# EAGLE schematic Instrument (EAGLE 6.5.0)
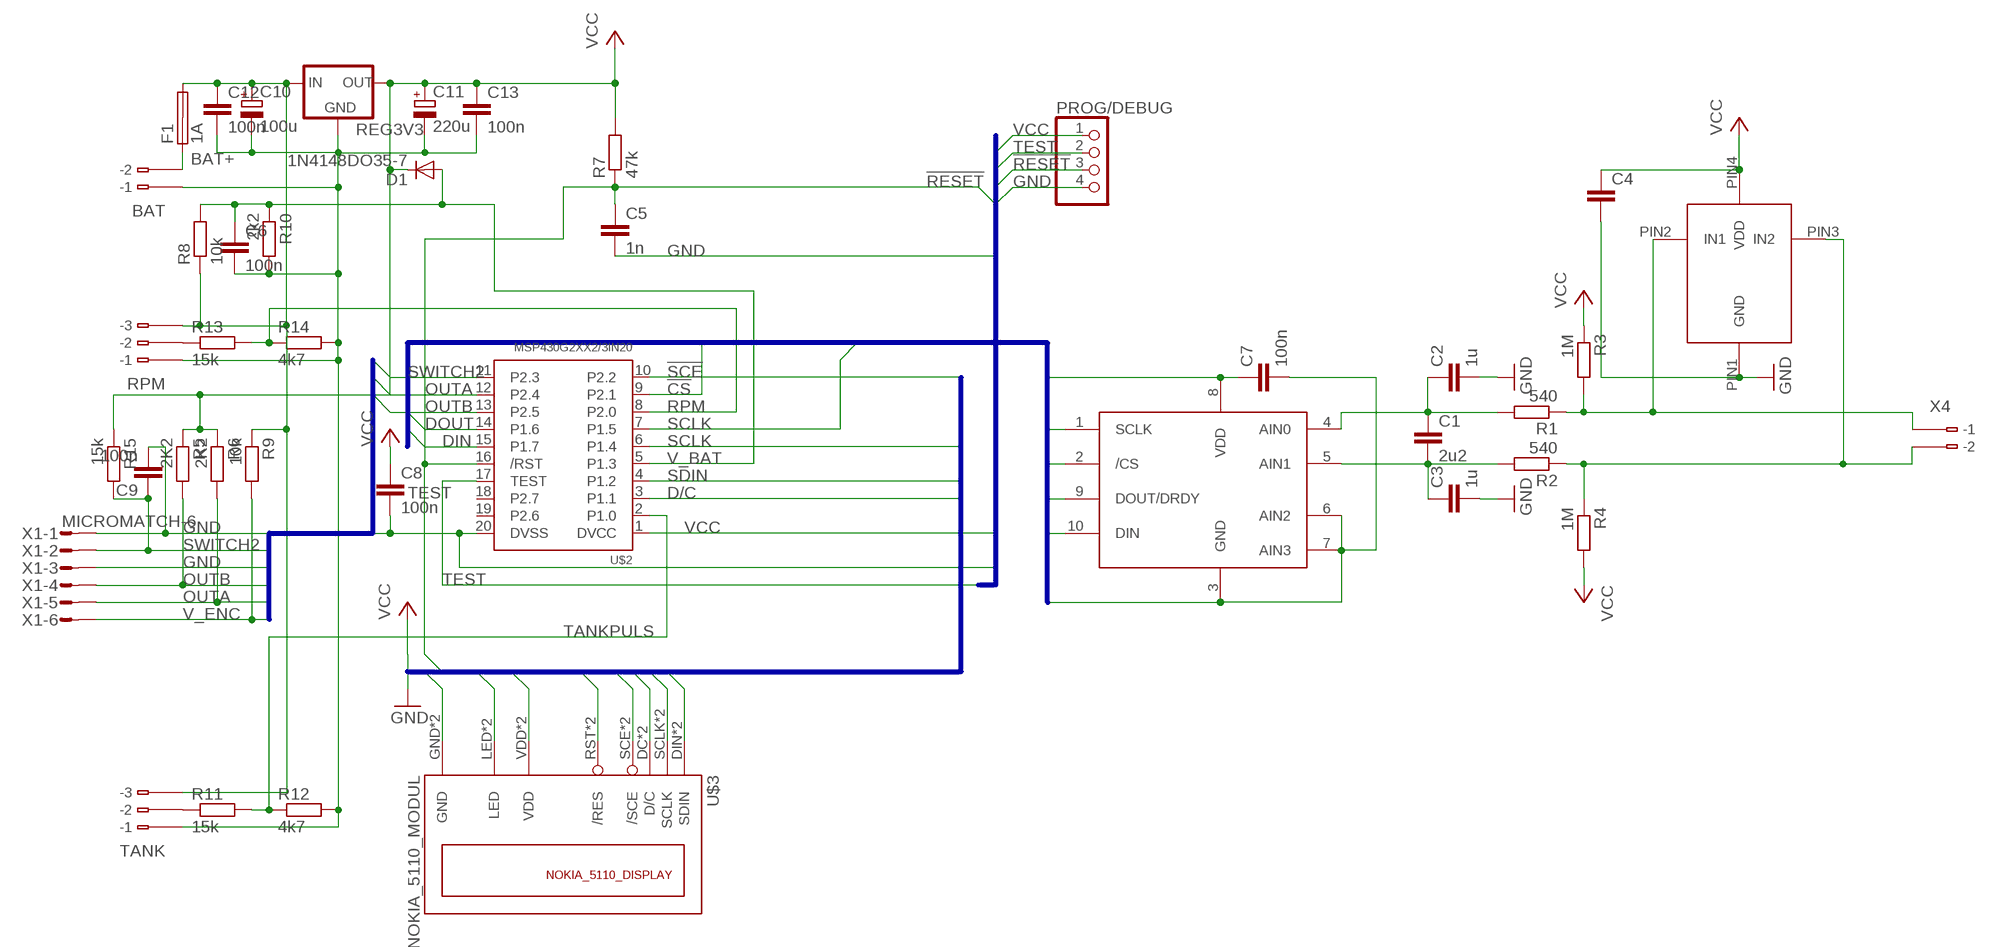
[diagram p0: schematic, sheet 1]

## Parts
BAT  233-102  [233-102]
C1  2u2  C-EU025-050X050  [C025-050X050]
C2  1u  C-EU025-050X050  [C025-050X050]
C3  1u  C-EU025-050X050  [C025-050X050]
C4  C-EU025-050X050  [C025-050X050]
C5  1n  C-EU025-024X044  [C025-024X044]
C6  100n  C-EU025-050X050  [C025-050X050]
C7  100n  C-EU025-050X050  [C025-050X050]
C8  100n  C-EU025-050X050  [C025-050X050]
C9  100n  C-EU025-050X050  [C025-050X050]
C10  100u  CPOL-EUE5-8.5  [E5-8,5]
C11  220u  CPOL-EUE5-8.5  [E5-8,5]
C12  100n  C-EU025-050X050  [C025-050X050]
C13  100n  C-EU025-050X050  [C025-050X050]
D1  1N4148DO35-7  [DO35-7]
F1  1A  SHK20Q  [SHK20Q]
PROG/DEBUG  PINHD-1X4  [1X04]
R1  540  R-EU_0207/2V  [0207/2V]
R2  540  R-EU_0207/2V  [0207/2V]
R3  1M  R-EU_0207/2V  [0207/2V]
R4  1M  R-EU_0207/2V  [0207/2V]
R5  2K2  R-EU_0207/2V  [0207/2V]
R6  2K2  R-EU_0207/2V  [0207/2V]
R7  47k  R-EU_0204/2V  [0204V]
R8  10k  R-EU_0204/5  [0204/5]
R9  10k  R-EU_0207/2V  [0207/2V]
R10  2k2  R-EU_0204/5  [0204/5]
R11  15k  R-EU_0207/2V  [0207/2V]
R12  4k7  R-EU_0207/2V  [0207/2V]
R13  15k  R-EU_0207/2V  [0207/2V]
R14  4k7  R-EU_0207/2V  [0207/2V]
R15  15k  R-EU_0207/2V  [0207/2V]
REG3V3  78MXXL  [78MXXL]
RPM  233-103  [233-103]
TANK  233-103  [233-103]
THERMO_ADC  ADS1118IDGST  [MSOP10]
U$1  TPD2E001DZDR  [PDSO-G4]
U$2  MSP430G2XX2/3IN20  [DIL20]
U$3  NOKIA_5110_MODUL  [CHINA_N5110]
X1  MICROMATCH-6  [MICROMATCH-6]
X4  233-102  [233-102]

## Nets
!CS: THERMO_ADC.2(/CS) U$2.9(P2.1)
!RESET: C5.1 PROG/DEBUG.3 R7.1 U$2.16(/RST) U$3.RST2(/RES) U$3.RST(/RES)
!SCE: U$2.10(P2.2) U$3.SCE2(/SCE) U$3.SCE(/SCE)
BAT+: C10.+ C12.1 F1.2A R8.1 R9.1 REG3V3.IN RPM.B3(B-3) TANK.B3(B-3)
D/C: U$2.3(P1.1) U$3.DC2(D/C) U$3.DC(D/C)
DIN: THERMO_ADC.10(DIN) U$2.15(P1.7)
DOUT: THERMO_ADC.9(DOUT/DRDY) U$2.14(P1.6)
GND: BAT.B1(B-1) C2.2 C3.2 C4.2 C5.2 C6.2 C7.2 C8.2 C9.2 C10.- C11.- C12.2 C13.2 PROG/DEBUG.4 R10.2 R12.2 R14.2 REG3V3.GND RPM.B1(B-1) TANK.B1(B-1) THERMO_ADC.3(GND) THERMO_ADC.6(AIN2) THERMO_ADC.7(AIN3) U$1.PIN1(GND) U$2.20(DVSS) U$3.GND U$3.GND2(GND) X1.1 X1.3
N$1: C1.1 C2.1 R1.2 THERMO_ADC.4(AIN0)
N$2: C1.2 C3.1 R2.2 THERMO_ADC.5(AIN1)
N$3: R1.1 R3.2 U$1.PIN2(IN1) X4.B1(B-1)
N$4: R2.1 R4.1 U$1.PIN3(IN2) X4.B2(B-2)
N$5: BAT.B2(B-2) F1.1A
N$6: R13.1 RPM.B2(B-2)
N$7: R11.1 TANK.B2(B-2)
OUTA: R6.2 U$2.12(P2.4) X1.5
OUTB: R5.2 U$2.13(P2.5) X1.4
RPM: R13.2 R14.1 U$2.8(P2.0)
SCLK: THERMO_ADC.1(SCLK) U$2.6(P1.4) U$2.7(P1.5) U$3.SCLK U$3.SCLK2(SCLK)
SDIN: U$2.4(P1.2) U$3.DIN2(SDIN) U$3.DIN(SDIN)
SWITCH2: C9.1 R15.2 U$2.11(P2.3) X1.2
TANKPULS: R11.2 R12.1 U$2.2(P1.0)
TEST: PROG/DEBUG.2 U$2.17(TEST)
V_BAT: C6.1 D1.A R8.2 R10.1 U$2.5(P1.3)
V_ENC: R9.2 X1.6
VCC: C4.1 C7.1 C8.1 C11.+ C13.1 D1.C PROG/DEBUG.1 R3.1 R4.2 R5.1 R6.1 R7.2 R15.1 REG3V3.OUT THERMO_ADC.8(VDD) U$1.PIN4(VDD) U$2.1(DVCC) U$3.LED U$3.LED2(LED) U$3.VDD U$3.VDD2(VDD)
Unconnected: BAT.A1(-1) BAT.A2(-2) F1.1B F1.2B RPM.A1(-1) RPM.A2(-2) RPM.A3(-3) TANK.A1(-1) TANK.A2(-2) TANK.A3(-3) U$2.18(P2.7) U$2.19(P2.6) X4.A1(-1) X4.A2(-2)

## Buses
GND,SWITCH1,SWITCH2,OUTA,OUTB,V_ENC
DISPLAY:GND,LED,VCC,!RESET,!SCE,SCLK,SDIN,D/C
VCC,GND,TEST,!RESET
VCC,GND,!CS,SCLK,DOUT,DIN

## Library data of the parts
BAT X4 = con-wago:233-102: WAGO Cage Clamp; MPN: 233-102; OC_FARNELL: unknown; OC_NEWARK: 28K9044
C1-C9 C12 C13 = rcl:C-EU: CAPACITOR, European symbol
C10 C11 = rcl:CPOL-EU: POLARIZED CAPACITOR, European symbol
D1 = diode:1N4148: DIODE high speed (Philips)
F1 = fuse:SHK20Q: FUSE HOLDER 5 x 20 mm, SH contact, E1207 Buerklin 64G6061; OC_FARNELL: unknown; OC_NEWARK: unknown
PROG/DEBUG = pinhead:PINHD-1X4: PIN HEADER
R1-R15 = rcl:R-EU_: RESISTOR, European symbol
REG3V3 = v-reg:78MXXL: VOLTAGE REGULATOR
RPM TANK = con-wago:233-103: WAGO Cage Clamp; MPN: 233-103; OC_FARNELL: unknown; OC_NEWARK: 28K9045
THERMO_ADC = instrument:ADS1118IDGST: The ADS1118 is a precision analog-to-digital converter (ADC) with 16 bits of resolution offered in an ultra-small, leadless QFN-10 package or an MSOP-10 package. The ADS1118 is designed with precision, power, and ease of implementation in mind.
U$1 = instrument:TPD2E001DZDR
U$2 = ti_msp430gxxx:MSP430G2XX2/3: Mixed Signal Microcontroller MSP430 Value Line MSP430G2432: 1x EEM, 8 KiB Flash Memory, 256 B RAM, 1x Timer_A, 1x USI, 8x ADC10 Ch, 16x I/O MSP430G2332: 1x EEM, 4 KiB Flash Memory, 256 B RAM, 1x Timer_A, 1x USI, 8x ADC10 Ch, 16x I/O MSP430G2232: 1x EEM, 2 KiB Flash Memory, 256 B RAM, 1x Timer_A, 1x USI, 8x ADC10 Ch, 16x I/O MSP430G2132: 1x EEM, 1 KiB Flash Memory, 128 B RAM, 1x Timer_A, 1x USI, 8x ADC10 Ch, 16x I/O MSP430G2402: 1x EEM, 8 KiB Flash Memory, 256 B RAM, 1x Timer_A, 1x USI, 16x I/O MSP430G2302: 1x EEM, 4 KiB Flash Memory, 256 B RAM, 1x Timer_A, 1x USI, 16x I/O MSP430G2202: 1x EEM, 2 KiB Flash Memory, 256 B RAM, 1x Timer_A, 1x USI, 16x I/O MSP430G2102: 1x EEM, 1 KiB Flash Memory, 128 B RAM, 1x Timer_A, 1x USI, 16x I/O MSP430G2452: 1x EEM, 8 KiB Flash Memory, 256 B RAM, 1x Timer_A, 8x Comp_A Ch, 1x USI, 8x ADC10 Ch, 16x I/O MSP430G2352: 1x EEM, 4 KiB Flash Memory, 256 B RAM, 1x Timer_A, 8x Comp_A Ch, 1x USI, 8x ADC10 Ch, 16x I/O MSP430G2252: 1x EEM, 2 KiB Flash Memory, 256 B RAM, 1x Timer_A, 8x Comp_A Ch, 1x USI, 8x ADC10 Ch, 16x I/O MSP430G2152: 1x EEM, 1 KiB Flash Memory, 128 B RAM, 1x Timer_A, 8x Comp_A Ch, 1x USI, 8x ADC10 Ch, 16x I/O MSP430G2412: 1x EEM, 8 KiB Flash Memory, 256 B RAM, 1x Timer_A, 8x Comp_A Ch, 1x USI, 16x I/O MSP430G2312: 1x EEM, 4 KiB Flash Memory, 256 B RAM, 1x Timer_A, 8x Comp_A Ch, 1x USI, 16x I/O MSP430G2212: 1x EEM, 2 KiB Flash Memory, 256 B RAM, 1x Timer_A, 8x Comp_A Ch, 1x USI, 16x I/O MSP430G2112: 1x EEM, 1 KiB Flash Memory, 128 B RAM, 1x Timer_A, 8x Comp_A Ch, 1x USI, 16x I/O MSP430G2533: 1x BSL, 1x EEM, 16 KiB Flash Memory, 512 B RAM, 2x Timer_A, 8x ADC10 Ch, 1x USCI A0/B0, 16x I/O MSP430G2433: 1x BSL, 1x EEM, 8 KiB Flash Memory, 512 B RAM, 2x Timer_A, 8x ADC10 Ch, 1x USCI A0/B0, 16x I/O MSP430G2333: 1x BSL, 1x EEM, 4 KiB Flash Memory, 256 B RAM, 2x Timer_A, 8x ADC10 Ch, 1x USCI A0/B0, 16x I/O MSP430G2233: 1x BSL, 1x EEM, 2 KiB Flash Memory, 256 B RAM, 2x Timer_A, 8x ADC10 Ch, 1x USCI A0/B0, 16x I/O MSP430G2403: 1x BSL, 1x EEM, 8 KiB Flash Memory, 512 B RAM, 2x Timer_A, 1x USCI A0/B0, 16x I/O MSP430G2303: 1x BSL, 1x EEM, 4 KiB Flash Memory, 256 B RAM, 2x Timer_A, 1x USCI A0/B0, 16x I/O MSP430G2203: 1x BSL, 1x EEM, 2 KiB Flash Memory, 256 B RAM, 2x Timer_A, 1x USCI A0/B0, 16x I/O MSP430G2553: 1x BSL, 1x EEM, 16 KiB Flash Memory, 512 B RAM, 2x Timer_A, 8x Comp_A+ Ch, 8x ADC10 Ch, 1x USCI A0/B0, 16x I/O MSP430G2453: 1x BSL, 1x EEM, 8 KiB Flash Memory, 512 B RAM, 2x Timer_A, 8x Comp_A+ Ch, 8x ADC10 Ch, 1x USCI A0/B0, 16x I/O MSP430G2353: 1x BSL, 1x EEM, 4 KiB Flash Memory, 256 B RAM, 2x Timer_A, 8x Comp_A+ Ch, 8x ADC10 Ch, 1x USCI A0/B0, 16x I/O MSP430G2253: 1x BSL, 1x EEM, 2 KiB Flash Memory, 256 B RAM, 2x Timer_A, 8x Comp_A+ Ch, 8x ADC10 Ch, 1x USCI A0/B0, 16x I/O MSP430G2153: 1x BSL, 1x EEM, 1 KiB Flash Memory, 256 B RAM, 2x Timer_A, 8x Comp_A+ Ch, 8x ADC10 Ch, 1x USCI A0/B0, 16x I/O MSP430G2513: 1x BSL, 1x EEM, 16 KiB Flash Memory, 512 B RAM, 2x Timer_A, 8x Comp_A+ Ch, 1x USCI A0/B0, 16x I/O MSP430G2413: 1x BSL, 1x EEM, 8 KiB Flash Memory, 512 B RAM, 2x Timer_A, 8x Comp_A+ Ch, 1x USCI A0/B0, 16x I/O MSP430G2313: 1x BSL, 1x EEM, 4 KiB Flash Memory, 256 B RAM, 2x Timer_A, 8x Comp_A+ Ch, 1x USCI A0/B0, 16x I/O MSP430G2213: 1x BSL, 1x EEM, 2 KiB Flash Memory, 256 B RAM, 2x Timer_A, 8x Comp_A+ Ch, 1x USCI A0/B0, 16x I/O MSP430G2113: 1x BSL, 1x EEM, 1 KiB Flash Memory, 256 B RAM, 2x Timer_A, 8x Comp_A+ Ch, 1x USCI A0/B0, 16x I/O
U$3 = lph-7366:NOKIA_5110_MODUL
X1 = con-amp-micromatch:MICROMATCH-6: MicroMaTch 6 7-215464-6 / 0-215464-6 Drawing Number C-215464 DDEController.pdf; MPN: 7-215464-6; OC_FARNELL: 3784630; OC_NEWARK: 19R8125